# Altium schematic sheet Mechanical.SchDoc
size Letter
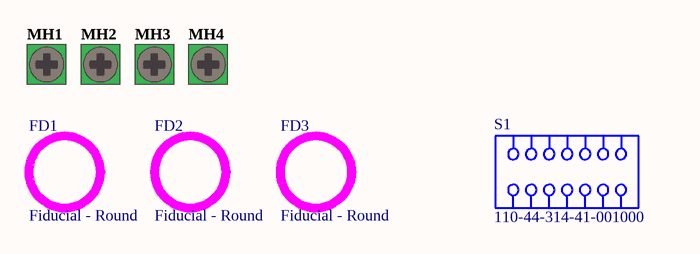
[diagram p0: Mechanical.SchDoc]

## Parts
FD1  Fiducial - Round  [FID150X450]  (no BOM)
FD2  Fiducial - Round  [FID150X450]  (no BOM)
FD3  Fiducial - Round  [FID150X450]  (no BOM)
MH1  Mounting-Hole-Screw  [MTG_M2_PV]  (value not drawn)  (no BOM)
MH2  Mounting-Hole-Screw  [MTG_M2_PV]  (value not drawn)  (no BOM)
MH3  Mounting-Hole-Screw  [MTG_M2_PV]  (value not drawn)  (no BOM)
MH4  Mounting-Hole-Screw  [MTG_M2_PV]  (value not drawn)  (no BOM)
S1  110-44-314-41-001000  (mechanical)

## Nets

Not connected (* = marked no-connect by the designer): MH1 1; MH2 1; MH3 1; MH4 1

## Library data of the parts
FD1-FD3 = Fiducial
MH1-MH4 = Mounting-Hole-Screw: Mounting Hole, Screw
S1 = SC-2P-F-R20: 110 Series Standard Solder Tail Open Frame Dual In-Line Socket - DIP-14